# EAGLE design PCB_pruebas (EAGLE 5.11)
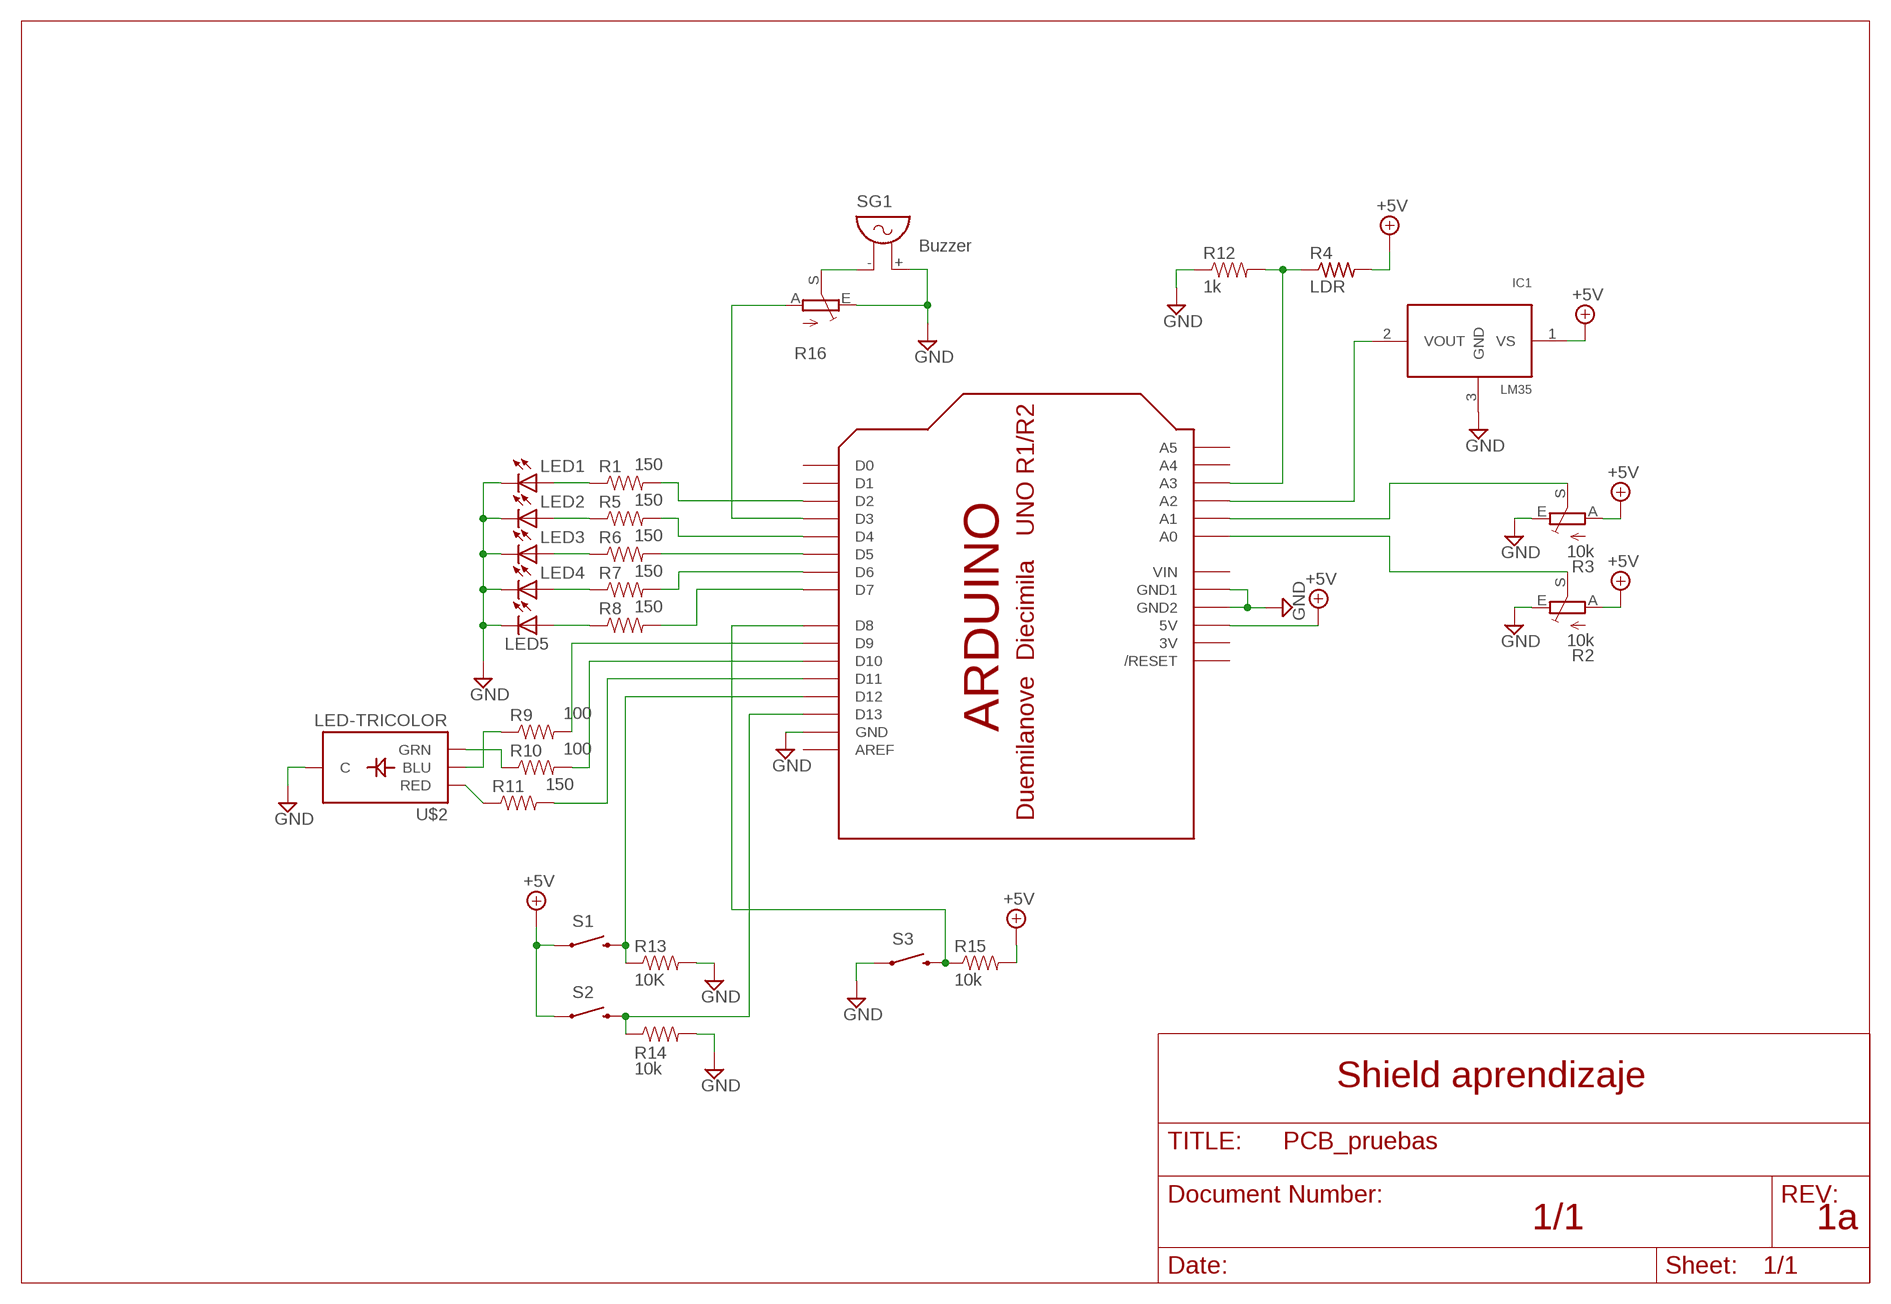
[diagram p0: schematic, sheet 1]

## Parts
IC1  LM35  [TO92-BCE]
LED1  LED5MM  [LED5MM]
LED2  LED5MM  [LED5MM]
LED3  LED5MM  [LED5MM]
LED4  LED5MM  [LED5MM]
LED5  LED5MM  [LED5MM]
R1  150  RESISTOR1206  [1206]
R2  10k  TRIM_EU-S63S  [S63S]
R3  10k  TRIM_EU-S63S  [S63S]
R4  LDR  R-US_0411/3V  [0411V]
R5  150  RESISTOR1206  [1206]
R6  150  RESISTOR1206  [1206]
R7  150  RESISTOR1206  [1206]
R8  150  RESISTOR1206  [1206]
R9  100  RESISTOR1206  [1206]
R10  100  RESISTOR1206  [1206]
R11  150  RESISTOR1206  [1206]
R12  1k  RESISTOR1206  [1206]
R13  10K  RESISTOR1206  [1206]
R14  10k  RESISTOR1206  [1206]
R15  10k  RESISTOR1206  [1206]
R16  TRIM_EU-CA9V  [CA9V]
S1  SWITCH-MOMENTARY-2PTH  [TACTILE-PTH]
S2  SWITCH-MOMENTARY-2PTH  [TACTILE-PTH]
S3  SWITCH-MOMENTARY-2PTH  [TACTILE-PTH]
SG1  Buzzer  F/QMX  [F/QMX]
U$1  ARDUINOUNO  [ARDUINO]
U$2  LED-TRICOLOR  LED-TRICOLOR-THROUGHHOLE  [LED-TRICOLOR-THROUGHHOLE]

## Nets
+5V: IC1.1(VS) R2.A R3.A R4.2 R15.2 S1.1 S2.1 U$1.5V
GND: IC1.3(GND) LED1.K(C) LED2.K(C) LED3.K(C) LED4.K(C) LED5.K(C) R2.E R3.E R12.1 R13.2 R14.2 R16.E S3.1 SG1.+ U$1.GND U$1.GND1 U$1.GND2 U$2.GND(C)
N$1: R1.2 U$1.D2
N$2: R5.2 U$1.D4
N$3: R6.2 U$1.D5
N$4: R7.2 U$1.D6
N$5: R8.2 U$1.D7
N$6: LED5.A R8.1
N$7: LED4.A R7.1
N$8: LED3.A R6.1
N$9: LED2.A R5.1
N$10: LED1.A R1.1
N$11: R16.S SG1.-
N$12: R9.1 U$2.BLU
N$13: R10.1 U$2.GRN
N$14: R11.1 U$2.RED
N$15: R9.2 U$1.D9
N$16: R10.2 U$1.D10
N$17: R11.2 U$1.D11
N$18: R2.S U$1.A0
N$19: R3.S U$1.A1
N$20: IC1.2(VOUT) U$1.A2
N$21: R15.1 S3.3 U$1.D8
N$22: R4.1 R12.2 U$1.A3
N$23: R16.A U$1.D3
N$24: R13.1 S1.3 U$1.D12
N$25: R14.1 S2.3 U$1.D13
Unconnected: U$1.A4 U$1.A5 U$1.AREF U$1.D0 U$1.D1 U$1.RESET(/RESET)

## Notes on the sheet
- Shield aprendizaje
- 1/1 | 1a

## Power pins joined to a net without a drawn wire
3V: U$1.3V
VIN: U$1.VIN

## Library data of the parts
IC1 = personal:LM35
LED1-LED5 = SparkFun:LED: LEDs Standard schematic elements and footprints for 5mm, 3mm, 1206, and 0603 sized LEDs. 5mm - Spark Fun Electronics SKU : COM-00529 (and others)
R1 R5-R15 = SparkFun:RESISTOR: Resistor Basic schematic elements and footprints for 0603, 1206, and PTH resistors.
R2 R3 R16 = pot:TRIM_EU-: POTENTIOMETER
R4 = personal:R-US_: RESISTOR, American symbol
S1-S3 = personal:SWITCH-MOMENTARY-2
SG1 = buzzer:F/QMX: BUZZER Source: Buerklin; OC_FARNELL: unknown; OC_NEWARK: unknown
U$1 = personal:ARDUINO: Arduino Diecimila/Duemilanove Make a shield with ease, this package has all the named pins as well as the two mounting drill holes and an outline of the USB and DC power connector. The outline is on the DIMENSION layer, so if your board house uses it they will cut the outline to match. http://www.ladyada.net/library/pcb/eaglelibrary.html
U$2 = personal:LED-TRICOLOR-THROUGHHOLE

## Net classes
0 *: width 0.406 mm, clearance 0.203 mm

## Board
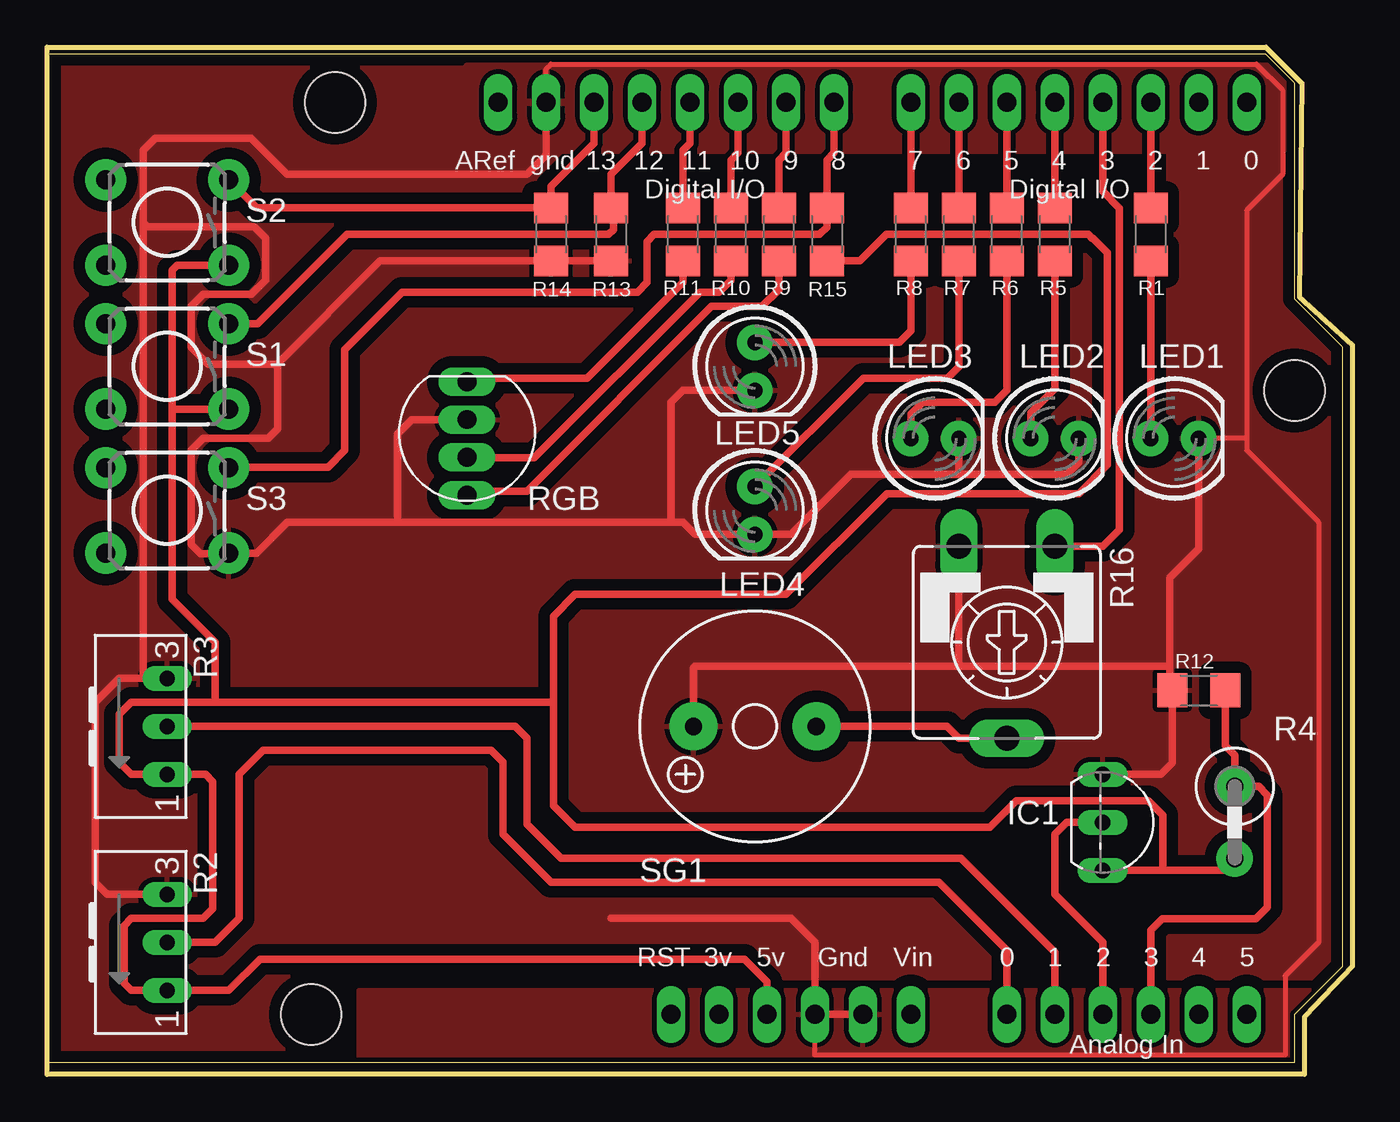
[diagram p1: board, top side]

Size 69.09 x 54.36 mm. Coordinates in mm from the lower left corner, seen from the top.
Outline: 0,0 0,54.36 64.52,54.36 66.42,52.45 66.29,41.15 69.09,38.61 69.09,5.71 66.55,3.05 66.55,0 0,0
Copper layers (1*16): Top 0.035mm / dielectric 1.5mm / Bottom 0.035mm
Design rules "default *": minimum track width 10mil, minimum drill 24mil, track to track 8mil, track to pad 8mil, pad to pad 8mil, via to via 8mil, smd to smd 8mil, copper to edge 6mil, drill to drill 6mil, minimum pad ring 10mil, minimum via ring 8mil, stop-mask expansion 4mil, vias tented up to drill 0mil, thermal gap 10mil

### Footprints (pad centres in the part's own frame; a part is rotated, then mirrored left to right if it is on the bottom)
TO92-BCE = drill 0.813 long: 1 2.54,0; 2 0,0; 3 -2.54,0
LED5MM = drill 0.813 pad 1.88 round: A -1.27,0; K 1.27,0
1206 = smd 1.6 x 1.8: 1 -1.4,0; 2 1.4,0
S63S = drill 0.813 long: A 2.54,1.27; E -2.54,1.27; S 0,1.27
0411V = drill 0.914 pad 1.93 round: 1 -2.54,0; 2 1.27,0
CA9V = drill 1.321 long: A -2.54,-5.08; E 2.54,-5.08; S 0,5.08
TACTILE-PTH = drill 1.016 pad 2.184 round: 1 -3.251,2.261; 2 3.251,2.261; 3 -3.251,-2.261; 4 3.251,-2.261
F/QMX = drill 0.914 pad 2.54 round: + 3.251,0; - -3.251,0
ARDUINO = drill 1 pad 1.27 long: 3V 35.56,2.54; 5V 38.1,2.54; A0 50.8,2.54; A1 53.34,2.54; A2 55.88,2.54; A3 58.42,2.54; A4 60.96,2.54; A5 63.5,2.54; AREF 23.876,50.8; D0 63.5,50.8; D1 60.96,50.8; D2 58.42,50.8; D3 55.88,50.8; D4 53.34,50.8; D5 50.8,50.8; D6 48.26,50.8; D7 45.72,50.8; D8 41.656,50.8; D9 39.116,50.8; D10 36.576,50.8; D11 34.036,50.8; D12 31.496,50.8; D13 28.956,50.8; GND 26.416,50.8; GND1 43.18,2.54; GND2 40.64,2.54; RESET 33.02,2.54; VIN 45.72,2.54 | hole 3.2: 15.24,50.8; 66.04,35.56; 13.97,2.54
LED-TRICOLOR-THROUGHHOLE = drill 1 long: BLU 3,0; GND -1,0; GRN 1,0; RED -3,0

### Placement (x,y rotation side)
IC1  55.88,13.33 270 top
LED1  59.69,33.66 0 top
LED2  53.34,33.66 0 top
LED3  46.99,33.66 0 top
LED4  37.47,29.85 270 top
LED5  37.47,37.46 270 top
R1  58.42,44.45 90 top
R2  5.08,6.98 270 top
R3  5.08,18.42 270 top
R4  62.87,12.7 270 top
R5  53.34,44.45 90 top
R6  50.8,44.45 90 top
R7  48.26,44.45 90 top
R8  45.72,44.45 90 top
R9  38.73,44.45 90 top
R10  36.2,44.45 90 top
R11  33.66,44.45 90 top
R12  60.96,20.32 0 top
R13  29.84,44.45 270 top
R14  26.67,44.45 270 top
R15  41.27,44.45 270 top
R16  50.8,22.86 180 top
S1  6.35,37.46 180 top
S2  6.35,45.09 180 top
S3  6.35,29.85 180 top
SG1  37.47,18.42 180 top
U$1  0,0.64 0 top
U$2  22.23,33.66 270 top

### Tracks (layer width: path | path; a pad name or v marks a point on that pad's centre or on a via)
+5V
  Top 0.406: R15.2 43.04,43.05 44.44,44.45 55.12,44.45 55.31,44.26 55.35,44.26 56.13,43.47 56.13,32.26 54.61,30.73 44.45,30.73 39.12,25.4 27.94,25.4 26.8,24.26 26.8,19.69 | 59.05,10.79 62.48,10.79 62.48,11.05 R4.2 | 59.05,10.79 IC1.1 | 59.05,10.79 59.05,13.72 58.29,14.48 51.31,14.48 49.91,13.08 27.94,13.08 26.8,14.22 26.8,19.69 | 8.89,19.69 4.45,19.69 3.81,19.05 3.81,16.51 4.45,15.88 R3.A 8.38,15.88 8.76,15.49 8.76,8.76 8.26,8.26 4.45,8.26 4.06,7.87 4.06,4.83 4.45,4.45 R2.A 9.61,4.45 11.26,6.1 36.9,6.1 38.1,4.9 U$1.5V | 8.89,19.69 8.89,22.86 6.6,25.15 6.6,35.05 | 8.89,19.69 26.8,19.69 | S2.1 6.88,42.82 6.6,42.54 6.6,35.05 | S1.1 6.76,35.2 6.6,35.05
GND
  Top 0.254: 40.64,6.98 40.64,1.02 65.53,1.02 65.53,5.21 67.31,6.98 67.31,29.21 63.5,33.02 63.5,33.66 | 63.5,33.66 63.5,45.72 65.41,47.62 65.41,52.07 64.01,53.47 26.67,53.47 26.42,53.21 U$1.GND | 63.5,33.66 LED1.K
  Top 0.406: 12.06,37.59 11.46,37.59 | 12.06,37.59 12.17,37.59 17.63,43.05 R14.2 R13.2 | IC1.3 58.95,15.88 59.56,16.48 R12.1 59.44,20.44 59.44,21.59 | U$1.GND 26.42,48.64 25.4,47.62 12.7,47.62 10.79,49.53 5.71,49.53 5.08,48.89 5.08,45.09 | 5.08,20.96 3.81,20.96 2.54,19.69 2.54,10.16 3.17,9.53 R2.E | 5.08,20.96 5.71,20.96 | 5.71,20.96 R3.E | 5.71,20.96 5.84,21.08 | S3.1 8.74,27.58 | 54.74,33.53 LED2.K 54.61,32.38 53.98,31.75 48.26,31.75 | LED1.K 60.96,27.81 59.44,26.29 59.44,21.59 | U$1.GND1 U$1.GND2 40.64,6.98 39.37,8.26 29.84,8.26 | S3.1 11.07,27.58 12.7,29.21 18.54,29.21 | 48.26,31.75 LED3.K | 33.02,29.21 33.66,29.21 34.29,28.58 39.37,28.58 42.55,31.75 48.26,31.75 | LED5.K 33.66,36.2 33.02,35.56 33.02,29.21 | 5.08,20.96 5.08,45.09 | 5.08,45.09 5.3,44.87 10.95,44.87 11.56,44.26 11.56,42.04 10.79,41.27 8.26,41.27 7.62,40.64 7.62,38.48 8.51,37.59 12.07,37.59 | S3.1 9.58,27.56 8.13,27.56 7.62,28.07 7.62,33.02 8.26,33.66 11.68,33.66 12.19,34.16 12.19,37.59 12.07,37.59 | 12.07,37.59 12.06,37.59 | SG1.+ 34.21,21.51 34.29,21.59 48.26,21.59 | U$2.GND 19.29,34.66 18.54,33.91 18.54,29.21 | 59.44,21.59 48.26,21.59 | 48.26,21.59 R16.E | 18.54,29.21 33.02,29.21
  pour Top (isolate 0.254): 22.23,48.89 65.41,48.89 65.41,53.34 22.23,53.34
  pour Top (isolate 0.254): 16.51,0 16.51,4.45 67.94,4.45 67.94,0
  pour Top (isolate 0.61): -0.64,54.61 22.23,54.61 22.23,48.89 66.67,48.89 66.67,41.91 69.85,38.73 69.85,5.71 69.22,5.08 30.48,5.08 30.48,0 -0.64,0
N$1
  Top 0.406: R1.2 U$1.D2
N$2
  Top 0.406: R5.2 U$1.D4
N$3
  Top 0.406: R6.2 U$1.D5
N$4
  Top 0.406: R7.2 U$1.D6
N$5
  Top 0.406: R8.2 U$1.D7
N$6
  Top 0.406: LED5.A 45.11,38.73 45.72,39.34 R8.1
N$7
  Top 0.406: R7.1 48.26,37.46 47.65,36.85 43.2,36.85 LED4.A
N$8
  Top 0.406: LED3.A 45.72,34.92 46.35,35.56 50.16,35.56 50.8,36.2 R6.1
N$9
  Top 0.406: LED2.A 52.07,35 53.34,36.27 R5.1
N$10
  Top 0.406: LED1.A R1.1
N$11
  Top 0.406: SG1.- 47.62,18.42 48.26,17.78 R16.S
N$12
  Top 0.406: R9.1 38.73,41.53 37.85,40.64 35.18,40.64 25.4,30.86 22.43,30.86 U$2.BLU
N$13
  Top 0.406: R10.1 36.2,42.04 35.56,41.4 34.54,41.4 25.78,32.64 22.24,32.64 U$2.GRN
N$14
  Top 0.406: R11.1 33.66,41.91 28.57,36.83 22.4,36.83 U$2.RED
N$15
  Top 0.406: R9.2 38.73,48.39 39.12,48.77 U$1.D9
N$16
  Top 0.406: R10.2 36.2,48.39 36.58,48.77 U$1.D10
N$17
  Top 0.406: U$1.D11 34.04,49.28 33.66,48.89 R11.2
N$18
  Top 0.406: U$1.A0 50.8,6.57 47.21,10.16 26.67,10.16 24.13,12.7 24.13,16.51 23.5,17.15 11.43,17.15 10.16,15.88 10.16,8.26 8.89,6.98 R2.S
N$19
  Top 0.406: U$1.A1 53.34,6.47 48.38,11.43 27.2,11.43 25.4,13.23 25.4,17.78 24.77,18.42 R3.S
N$20
  Top 0.406: IC1.2 53.98,13.33 53.34,12.7 53.34,9.53 55.88,6.98 U$1.A2
N$21
  Top 0.406: U$1.D8 41.66,48.77 41.27,48.39 R15.1 41.27,44.83 40.89,44.45 32.13,44.45 31.75,44.07 31.75,41.91 31.24,41.4 18.8,41.4 15.75,38.35 15.75,33.02 14.86,32.13 9.63,32.13 S3.3
N$22
  Top 0.406: U$1.A3 58.42,7.63 59.03,8.25 63.98,8.25 64.59,8.86 64.59,14.78 64.14,15.24 R4.1 62.87,16.88 62.36,17.39 R12.2
N$23
  Top 0.406: U$1.D3 55.88,46.74 56.77,45.85 56.77,28.83 55.88,27.94 R16.A
N$24
  Top 0.406: U$1.D12 31.5,49.28 29.84,47.62 R13.1 29.97,45.72 29.97,44.7 29.72,44.45 15.88,44.45 11.15,39.73 S1.3
N$25
  Top 0.406: S2.3 11.1,45.85 R14.1 26.67,46.99 28.96,49.28 U$1.D13

### Text on the board
tNames: RGB